# Altium project PROJECT-BATTERY-PCM.PrjPcb
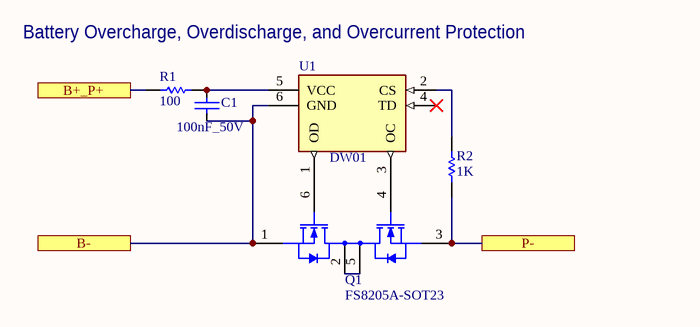
[diagram p0: BATTERY-PCM.SchDoc]
1 sheet, 5 parts. Net scope: flat (ports and power ports of the same name join across sheets).
Board file: BATTERY-PCM.PcbDoc

## Sheet BATTERY-PCM.SchDoc: 1-Cell 3.7V Li-Ion Battery PCM
size A4; Author: Meysam Parvizi; DrawnBy: Meysam Parvizi; Engineer: Meysam Parvizi; SheetNumber: 1; SheetTotal: 1

### Parts
C1  value 100nF_50V  [C0402]  (hidden comment: C0805C104K5RAC7411)
Q1  FS8205A-SOT23  [SOT-23-6]
R1  value 100  [R0402]  (hidden comment: CRG0805F10K)
R2  value 1K  [R0402]  (hidden comment: CRG0805F10K)
U1  DW01  [SOT-23-6]

### Ports
B+_P+, B-, P-

### Nets
B+_P+: R1.1 ; port B+_P+
B-: C1.2 Q1.1(S1) U1.6(GND) ; port B-
P-: Q1.3(S2) R2.2 ; port P-
NetC1_1: C1.1 R1.2 U1.5(VCC)
NetQ1_2: Q1.2(D1) Q1.5(D2)
NetQ1_4: Q1.4(G2) U1.3(OC)
NetQ1_6: Q1.6(G1) U1.1(OD)
NetR2_1: R2.1 U1.2(CS)

Not connected (* = marked no-connect by the designer): U1 4(TD)*

### Notes on the sheet
- Battery Overcharge, Overdischarge, and Overcurrent Protection
- Title:
- Designed By:
- Meysam Parvizi
- GitHub:
- https://github.com/m3y54m
- File:
- Project Git Hash:
- Project:
- Date:
- Sheet
- Revision:
- of
- Size:
- A4
- File Git Hash:

### Library data of the parts
C1 = CAPACITOR: C0805 0.10 μF X7R 30ppm/°C 10.00% 50 V; Manufacturer: KEMET; Material: Ceramic; Tolerance: 0.1; Capacitance: 100nF; Voltage Rating: 50 V; Temperature: -55°C to +125°C; Device Class L3: Ceramic Capacitors; Temperature Characteristic: X7R; Device Class L1: Passive Components; Category: Cap; Temperature Coefficient: 30ppm/°C; Manufacturer Part Number: C0805C104K5RAC7411; Temperature Range High: +125°C; Height: 0.88mm; RoHS: TRUE; ComponentLink2Description: Datasheet; Lead Free: Yes; Package: C0805C-DN; Temperature Range Low: -55°C; ComponentLink2URL: https://content.kemet.com/datasheets/KEM_C1003_C0G_SMD.pdf; Automotive: No; Ipc Land Pattern Name: CAPC200125X78; Octopart: https://octopart.com/c0805c104k5rac7411-kemet-18508045; Device Class L2: Capacitors
Q1 = FS8205A-SOT23: Dual N-Channel Enhancement Mode Power MOSFET; MF: Fortune Semiconductor; Value: *; Price: None; Package: Package Analog Devices; SnapEDA_Link: https://www.snapeda.com/parts/FS8205A/Fortune%20Semiconductor/view-part/3217108/?ref=snap; Availability: Unavailable; MP: FS8205A
R1 R2 = RESISTOR: RES SMD 10K OHM 1% 1/8W 0805; Temperature Coefficient: 100ppm/°C; Power Rating: 125mW; Voltage Rating: 150V; Number of Resistors: 1; RoHS Compliant: Yes; Tolerance: 1%; Mount: Surface Mount; Radiation Hardening: No; Depth: 1.25mm; Termination: Solder; Series: CRG Series; Packaging: Tape and Reel; Number of Terminations: 2; Resistor Type: Thick Film; Length: 2mm; Height: 0.55mm; ELV: Compliant; Case/Package: 0805; Min Operating Temperature: -55°C; Max Operating Temperature: 125°C; Technology: THICK FILM
U1 = DW01: One Cell Lithium-ion/Polymer Battery Protection IC; MF: Fortune Semiconductor; MP: DW01A; Price: None; Availability: Unavailable; Package: Package Analog Devices; SnapEDA_Link: https://www.snapeda.com/parts/DW01A/Fortune%20Semiconductor/view-part/4388554/?ref=snap; Value: *